# Altium schematic sheet EC25.SchDoc
size A4; SheetNumber: 3; SheetTotal: 3
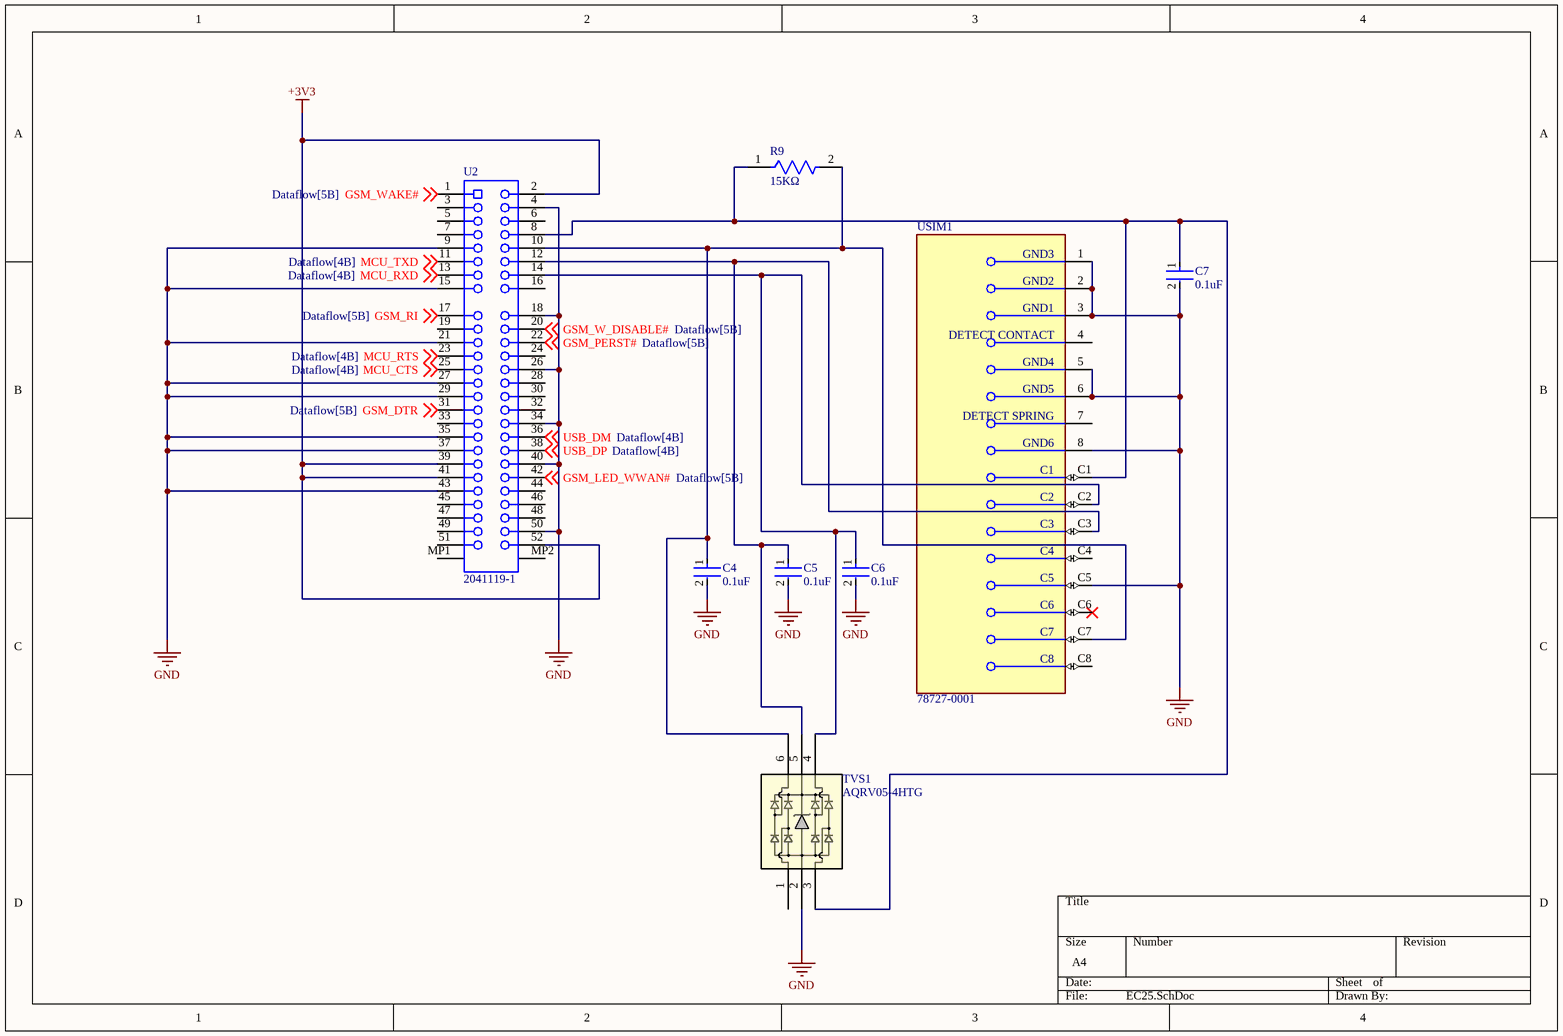
[diagram p0: EC25.SchDoc]

## Parts
C4  0.1uF  [FP-C0603C-CF-MFG]
C5  0.1uF  [FP-C0603C-CF-MFG]
C6  0.1uF  [FP-C0603C-CF-MFG]
C7  0.1uF  [FP-C0603C-CF-MFG]
R9  15KΩ  [FP-CRGP2512-IPC_C]
TVS1  AQRV05-4HTG  [SOT23-6_LTF]
U2  2041119-1  [TECO-2041119-1_3_V]
USIM1  78727-0001  [FP-78727-0001-MFG]

## Nets
+3V3: U2.2 U2.39 U2.41 U2.52
GND: C4.2 C5.2 C6.2 C7.2 TVS1.2 U2.4 U2.9 U2.15 U2.18 U2.21 U2.26 U2.27 U2.29 U2.34 U2.35 U2.37 U2.40 U2.43 U2.50 USIM1.1(GND3) USIM1.2(GND2) USIM1.3(GND1) USIM1.5(GND4) USIM1.6(GND5) USIM1.8(GND6) USIM1.C5
GSM_DTR: U2.31 ; off-sheet GSM_DTR
GSM_LED_WWAN#: U2.42 ; off-sheet GSM_LED_WWAN#
GSM_PERST#: U2.22 ; off-sheet GSM_PERST#
GSM_RI: U2.17 ; off-sheet GSM_RI
GSM_W_DISABLE#: U2.20 ; off-sheet GSM_W_DISABLE#
GSM_WAKE#: U2.1 ; off-sheet GSM_WAKE#
MCU_CTS: U2.25 ; off-sheet MCU_CTS
MCU_RTS: U2.23 ; off-sheet MCU_RTS
MCU_RXD: U2.13 ; off-sheet MCU_RXD
MCU_TXD: U2.11 ; off-sheet MCU_TXD
USB_DM: U2.36 ; off-sheet USB_DM
USB_DP: U2.38 ; off-sheet USB_DP
NetC4_1: C4.1 R9.2 TVS1.6 U2.10 USIM1.C7
NetC5_1: C5.1 TVS1.5 U2.12 USIM1.C3
NetC6_1: C6.1 TVS1.4 U2.14 USIM1.C2
NetC7_1: C7.1 R9.1 TVS1.3 U2.8 USIM1.C1

Not connected (* = marked no-connect by the designer): TVS1 1; U2 3 5 6 7 16 19 24 28 30 32 33 44 45 46 47 48 49 51 MP1 MP2; USIM1 4(DETECT_CONTACT) 7(DETECT_SPRING) C4 C6* C8

## Library data of the parts
C4-C7 = CMP-2006-03056-2: C0603C104J5RACTU CAP CER 0.1UF 50V 5% X7R 0603; Manufacturer: KEMET; Automotive Grade: Grade 1; Tolerance: 0.05; Capacitance: 0.10 μF; Value: 0.10 μF; Material: Ceramic; Temperature Coefficient: 30ppm/°C; ComponentLink2Description: Datasheet; Voltage Rating: 50 V; Digikey Description: CAP CER 0.1UF 50V 5% X7R 0603; Manufacturer Part Number: C0603C104J5RACTU; Temperature Range High: +125°C; Device Class L2: Capacitors; Octopart: https://octopart.com/c0603c104j5ractu-kemet-10440638; RoHS: TRUE; Mouser Description: Multilayer Ceramic Capacitors MLCC - SMD/SMT 50volts 0.1uF X7R 5%; Temperature Range Low: -55°C; Automotive: Yes; Lead Free: Yes; ComponentLink2URL: https://api.kemet.com/component-edge/download/datasheet/C0603C100J5GACAUTO.pdf; Device Class L3: Ceramic Capacitors; Package: C0603C-CF; Category: Cap; Temperature: -55°C to +125°C; Height: 0.87mm; Temperature Characteristic: X7R; Device Class L1: Passive Components
R9 = CMP-03211-008564-1: CRGP2512F15K CRGP2512 15KΩ 2W ±100ppm/°C 1% 500V; Manufacturer: TE; Tolerance: 0.01; Temperature Coefficient: ±100ppm/°C; Manufacturer Part Number: CRGP2512F15K; Automotive: No; Resistance: 15KΩ; Temperature: -55°C to +155°C; ComponentLink2URL: https://www.mouser.ca/datasheet/2/418/NG_DS_9-1773463-9_A-1358566.pdf; Voltage Rating: 500V; RoHS: TRUE; Device Class L1: Passive Components; Ipc Land Pattern Name: RESC635320X55; Composition: Thick Film; Ambient Temperature Range High: +70°C; Height: 0.65mm; Package: CRGP2512; Lead Free: Yes; Power Rating: 2W; Device Class L2: Resistors; Category: Res; ComponentLink2Description: Datasheet; Value: 15KΩ; Temperature Range High: +155°C; Octopart: https://octopart.com/crgp2512f15k-te+connectivity-91019034; Description: CRGP2512 15KΩ 2W ±100ppm/°C 1% 500V; Temperature Range Low: -55°C; Device Class L3: Chip SMD Resistors; Series: CRGP
TVS1 = AQRV05-4HTG: No Description Available; Mfr_Name: Littelfuse Inc; RefDes: RefDes; Type: Type
U2 = CMP-2011-00000-2: mSATA & PCI Express Mini Card Connector, Pitch 0.4 mm, 52 Position, Height 4 mm, RoHS, Tape and Reel; Manufacturer: TE Connectivity; Case\Package: SMD; Rows: 2; Contacts: 52; Contact Material: Copper; Orientation: RightAngle; Width: 9.02mm; Mounting Technology: SurfaceMount; ELV: Compliant; Contact Plating: Gold; Termination: Solder; Datasheet URL: http://www.te.com/commerce/DocumentDelivery/DDEController?Action=showdoc&DocId=Customer+Drawing%7F2041119%7FD%7Fpdf%7FEnglish%7FENG_CD_2041119_D.pdf%7F2041119-1; Height: 4mm; Manufacturer URL: http://www.te.com/; Datasheet Version: 06/2016; RoHSCompliant: true; Length: 29.9mm; Package Description: mSATA & PCI Express Mini Card Connector, Pitch 0.4 mm, 52 Position, Height 4 mm; Housing Colour: Black; Housing Material: Polymer; Packaging: TapeandReel; Mount: SurfaceMount; Radiation Hardening: No; Package Reference: 2041119-1_3; Poles: 52
USIM1 = CMP-04763-000002-1: CONN MICRO SIM CARD PUSH-PULL; Manufacturer: Molex; Voltage Rating: 10V; Is Female: yes; Current Rating: 0.5A; Conn Orientation: Horizontal; Number Of Contacts: 6; Pitch: 2.54mm; Shielding: true; Octopart: https://octopart.com/78727-0001-molex-24436211; Manufacturer Part Number: 78727-0001; Temperature Range High: +85°C; Temperature Range Low: -40°C; ComponentLink2Description: Datasheet; Digikey Description: CONN MICRO SIM CARD PUSH-PULL; Temperature: -40°C to +85°C; Device Class L1: Connectors; Category: Conn; Device Class L2: Memory Connectors; Package: 78727-0001; Contact Material: Gold,Nickel; Footprint Url: https://www.molex.com/pdm_docs/sd/787270001_sd.pdf; Automotive: No; RoHS: TRUE; Mouser Description: Micro-SIM Card holder Temperature range: -40 ... +85 °C Contact material: Copper Poles: 6; Lead Free: Yes; Height: 1.52mm; ComponentLink2URL: https://www.molex.com/webdocs/datasheets/pdf/en-us/0787270001_MEMORY_CARD_SOCKET.pdf; Device Class L3: unset